# Altium schematic sheet Gen_Ai_Kbd-Main.SchDoc
size 420 x 297 mm; SheetNumber: 1; SheetTotal: 11
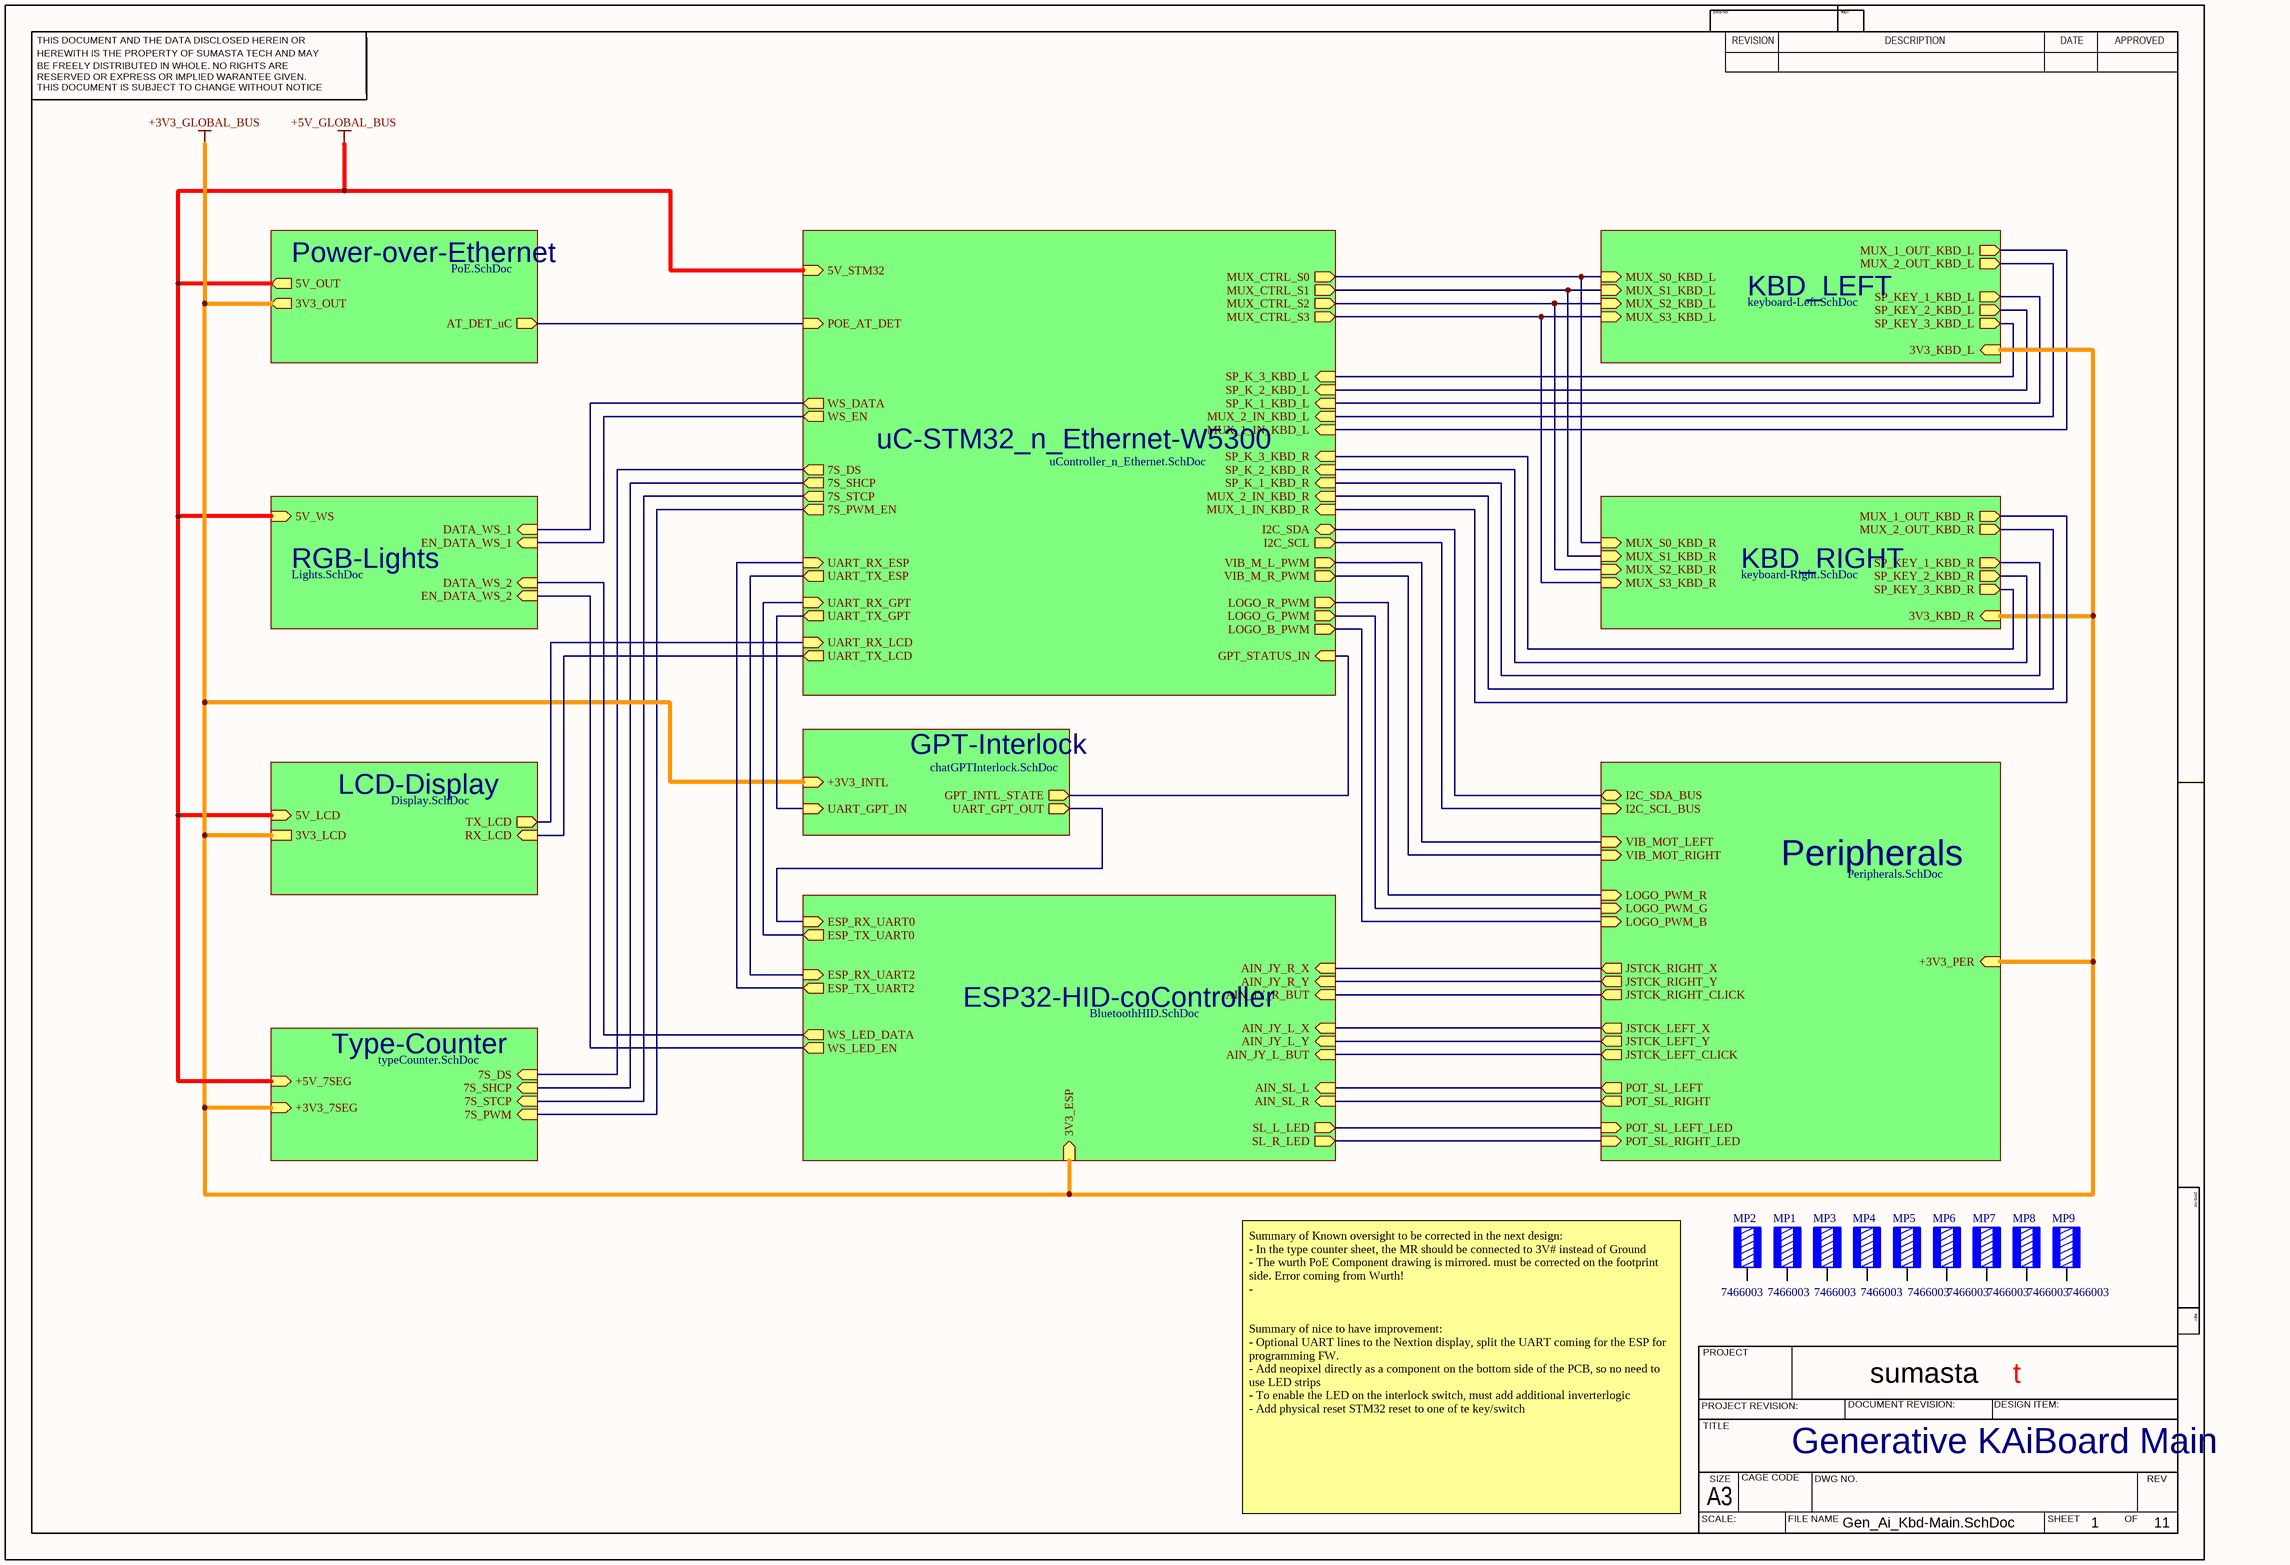
[diagram p0: Gen_Ai_Kbd-Main.SchDoc]

## Parts
MP1  7466003  [7466003]
MP2  7466003  [7466003]
MP3  7466003  [7466003]
MP4  7466003  [7466003]
MP5  7466003  [7466003]
MP6  7466003  [7466003]
MP7  7466003  [7466003]
MP8  7466003  [7466003]
MP9  7466003  [7466003]

## Sub-sheets
ESP32-HID-coController = BluetoothHID.SchDoc: 3V3_ESP (in), AIN_JY_L_X (in), AIN_JY_L_Y (in), AIN_JY_R_X (in), AIN_JY_R_Y (in), AIN_SL_R (in), AIN_SL_L (in), AIN_JY_L_BUT (in), AIN_JY_R_BUT (in), ESP_RX_UART2 (in), ESP_TX_UART2 (out), SL_R_LED (out), SL_L_LED (out), ESP_RX_UART0 (in), ESP_TX_UART0 (out), WS_LED_DATA (out), WS_LED_EN (out)
GPT-Interlock = chatGPTInterlock.SchDoc: +3V3_INTL (in), UART_GPT_IN (in), UART_GPT_OUT (out), GPT_INTL_STATE (out)
KBD_LEFT = keyboard-Left.SchDoc: MUX_S0_KBD_L (in), MUX_S1_KBD_L (in), MUX_S2_KBD_L (in), MUX_S3_KBD_L (in), 3V3_KBD_L (in), MUX_1_OUT_KBD_L (out), MUX_2_OUT_KBD_L (out), SP_KEY_1_KBD_L (out), SP_KEY_2_KBD_L (out), SP_KEY_3_KBD_L (out)
KBD_RIGHT = keyboard-Right.SchDoc: MUX_S0_KBD_R (in), MUX_S1_KBD_R (in), MUX_S2_KBD_R (in), MUX_S3_KBD_R (in), 3V3_KBD_R (in), MUX_1_OUT_KBD_R (out), MUX_2_OUT_KBD_R (out), SP_KEY_1_KBD_R (out), SP_KEY_2_KBD_R (out), SP_KEY_3_KBD_R (out)
LCD-Display = Display.SchDoc: 5V_LCD (in), TX_LCD (out), RX_LCD (in), 3V3_LCD
Peripherals = Peripherals.SchDoc: +3V3_PER (in), JSTCK_LEFT_X (out), JSTCK_LEFT_Y (out), JSTCK_LEFT_CLICK (out), JSTCK_RIGHT_X (out), JSTCK_RIGHT_Y (out), JSTCK_RIGHT_CLICK (out), LOGO_PWM_R (in), LOGO_PWM_G (in), LOGO_PWM_B (in), I2C_SDA_BUS (bidir), I2C_SCL_BUS (in), POT_SL_LEFT (out), POT_SL_RIGHT (out), POT_SL_LEFT_LED (in), POT_SL_RIGHT_LED (in), VIB_MOT_LEFT (in), VIB_MOT_RIGHT (in)
Power-over-Ethernet = PoE.SchDoc: AT_DET_uC (out), 5V_OUT (out), 3V3_OUT (out)
RGB-Lights = Lights.SchDoc: 5V_WS (in), DATA_WS_1 (in), DATA_WS_2 (in), EN_DATA_WS_1 (in), EN_DATA_WS_2 (in)
Type-Counter = typeCounter.SchDoc: +5V_7SEG (in), +3V3_7SEG (in), 7S_DS (in), 7S_SHCP (in), 7S_STCP (in), 7S_PWM (in)
uC-STM32_n_Ethernet-W5300 = uController_n_Ethernet.SchDoc: I2C_SCL (out), I2C_SDA (bidir), LOGO_R_PWM (out), LOGO_G_PWM (out), LOGO_B_PWM (out), VIB_M_L_PWM (out), VIB_M_R_PWM (out), MUX_1_IN_KBD_R (in), MUX_CTRL_S0 (out), MUX_CTRL_S1 (out), MUX_CTRL_S2 (out), MUX_CTRL_S3 (out), SP_K_1_KBD_L (in), SP_K_2_KBD_L (in), SP_K_3_KBD_L (in), SP_K_1_KBD_R (in), SP_K_2_KBD_R (in), SP_K_3_KBD_R (in), 7S_DS (out), 7S_SHCP (out), 7S_STCP (out), 7S_PWM_EN (out), POE_AT_DET (in), UART_TX_LCD (out), UART_RX_LCD (in), UART_RX_GPT (in), UART_TX_GPT (out), UART_TX_ESP (out), UART_RX_ESP (in), WS_DATA (out), WS_EN (out), 5V_STM32 (in), GPT_STATUS_IN (in), MUX_2_IN_KBD_L (in), MUX_1_IN_KBD_L (in), MUX_2_IN_KBD_R (in)

## Nets
+3V3_GLOBAL_BUS: sheet KBD_LEFT/3V3_KBD_L, sheet KBD_RIGHT/3V3_KBD_R, sheet Power-over-Ethernet/3V3_OUT, sheet LCD-Display/3V3_LCD, sheet Peripherals/+3V3_PER, sheet ESP32-HID-coController/3V3_ESP, sheet Type-Counter/+3V3_7SEG, sheet GPT-Interlock/+3V3_INTL
+5V_GLOBAL_BUS: sheet Power-over-Ethernet/5V_OUT, sheet RGB-Lights/5V_WS, sheet LCD-Display/5V_LCD, sheet uC-STM32_n_Ethernet-W5300/5V_STM32, sheet Type-Counter/+5V_7SEG
(unnamed): sheet KBD_LEFT/MUX_S0_KBD_L, sheet KBD_RIGHT/MUX_S0_KBD_R, sheet uC-STM32_n_Ethernet-W5300/MUX_CTRL_S0
(unnamed): sheet KBD_LEFT/MUX_S1_KBD_L, sheet KBD_RIGHT/MUX_S1_KBD_R, sheet uC-STM32_n_Ethernet-W5300/MUX_CTRL_S1
(unnamed): sheet KBD_LEFT/MUX_S2_KBD_L, sheet KBD_RIGHT/MUX_S2_KBD_R, sheet uC-STM32_n_Ethernet-W5300/MUX_CTRL_S2
(unnamed): sheet KBD_LEFT/MUX_S3_KBD_L, sheet KBD_RIGHT/MUX_S3_KBD_R, sheet uC-STM32_n_Ethernet-W5300/MUX_CTRL_S3
(unnamed): sheet KBD_LEFT/MUX_1_OUT_KBD_L, sheet uC-STM32_n_Ethernet-W5300/MUX_1_IN_KBD_L
(unnamed): sheet KBD_LEFT/MUX_2_OUT_KBD_L, sheet uC-STM32_n_Ethernet-W5300/MUX_2_IN_KBD_L
(unnamed): sheet KBD_LEFT/SP_KEY_1_KBD_L, sheet uC-STM32_n_Ethernet-W5300/SP_K_1_KBD_L
(unnamed): sheet KBD_LEFT/SP_KEY_2_KBD_L, sheet uC-STM32_n_Ethernet-W5300/SP_K_2_KBD_L
(unnamed): sheet KBD_LEFT/SP_KEY_3_KBD_L, sheet uC-STM32_n_Ethernet-W5300/SP_K_3_KBD_L
(unnamed): sheet KBD_RIGHT/MUX_1_OUT_KBD_R, sheet uC-STM32_n_Ethernet-W5300/MUX_1_IN_KBD_R
(unnamed): sheet KBD_RIGHT/MUX_2_OUT_KBD_R, sheet uC-STM32_n_Ethernet-W5300/MUX_2_IN_KBD_R
(unnamed): sheet KBD_RIGHT/SP_KEY_1_KBD_R, sheet uC-STM32_n_Ethernet-W5300/SP_K_1_KBD_R
(unnamed): sheet KBD_RIGHT/SP_KEY_2_KBD_R, sheet uC-STM32_n_Ethernet-W5300/SP_K_2_KBD_R
(unnamed): sheet KBD_RIGHT/SP_KEY_3_KBD_R, sheet uC-STM32_n_Ethernet-W5300/SP_K_3_KBD_R
(unnamed): sheet Power-over-Ethernet/AT_DET_uC, sheet uC-STM32_n_Ethernet-W5300/POE_AT_DET
(unnamed): sheet RGB-Lights/DATA_WS_1, sheet uC-STM32_n_Ethernet-W5300/WS_DATA
(unnamed): sheet RGB-Lights/DATA_WS_2, sheet ESP32-HID-coController/WS_LED_DATA
(unnamed): sheet RGB-Lights/EN_DATA_WS_1, sheet uC-STM32_n_Ethernet-W5300/WS_EN
(unnamed): sheet RGB-Lights/EN_DATA_WS_2, sheet ESP32-HID-coController/WS_LED_EN
(unnamed): sheet LCD-Display/TX_LCD, sheet uC-STM32_n_Ethernet-W5300/UART_RX_LCD
(unnamed): sheet LCD-Display/RX_LCD, sheet uC-STM32_n_Ethernet-W5300/UART_TX_LCD
(unnamed): sheet Peripherals/JSTCK_LEFT_X, sheet ESP32-HID-coController/AIN_JY_L_X
(unnamed): sheet Peripherals/JSTCK_LEFT_Y, sheet ESP32-HID-coController/AIN_JY_L_Y
(unnamed): sheet Peripherals/JSTCK_LEFT_CLICK, sheet ESP32-HID-coController/AIN_JY_L_BUT
(unnamed): sheet Peripherals/JSTCK_RIGHT_X, sheet ESP32-HID-coController/AIN_JY_R_X
(unnamed): sheet Peripherals/JSTCK_RIGHT_Y, sheet ESP32-HID-coController/AIN_JY_R_Y
(unnamed): sheet Peripherals/JSTCK_RIGHT_CLICK, sheet ESP32-HID-coController/AIN_JY_R_BUT
(unnamed): sheet Peripherals/LOGO_PWM_R, sheet uC-STM32_n_Ethernet-W5300/LOGO_R_PWM
(unnamed): sheet Peripherals/LOGO_PWM_G, sheet uC-STM32_n_Ethernet-W5300/LOGO_G_PWM
(unnamed): sheet Peripherals/LOGO_PWM_B, sheet uC-STM32_n_Ethernet-W5300/LOGO_B_PWM
(unnamed): sheet Peripherals/I2C_SDA_BUS, sheet uC-STM32_n_Ethernet-W5300/I2C_SDA
(unnamed): sheet Peripherals/I2C_SCL_BUS, sheet uC-STM32_n_Ethernet-W5300/I2C_SCL
(unnamed): sheet Peripherals/POT_SL_LEFT, sheet ESP32-HID-coController/AIN_SL_L
(unnamed): sheet Peripherals/POT_SL_RIGHT, sheet ESP32-HID-coController/AIN_SL_R
(unnamed): sheet Peripherals/POT_SL_LEFT_LED, sheet ESP32-HID-coController/SL_L_LED
(unnamed): sheet Peripherals/POT_SL_RIGHT_LED, sheet ESP32-HID-coController/SL_R_LED
(unnamed): sheet Peripherals/VIB_MOT_LEFT, sheet uC-STM32_n_Ethernet-W5300/VIB_M_L_PWM
(unnamed): sheet Peripherals/VIB_MOT_RIGHT, sheet uC-STM32_n_Ethernet-W5300/VIB_M_R_PWM
(unnamed): sheet uC-STM32_n_Ethernet-W5300/7S_DS, sheet Type-Counter/7S_DS
(unnamed): sheet uC-STM32_n_Ethernet-W5300/7S_SHCP, sheet Type-Counter/7S_SHCP
(unnamed): sheet uC-STM32_n_Ethernet-W5300/7S_STCP, sheet Type-Counter/7S_STCP
(unnamed): sheet uC-STM32_n_Ethernet-W5300/7S_PWM_EN, sheet Type-Counter/7S_PWM
(unnamed): sheet uC-STM32_n_Ethernet-W5300/UART_RX_GPT, sheet ESP32-HID-coController/ESP_TX_UART0
(unnamed): sheet uC-STM32_n_Ethernet-W5300/UART_TX_GPT, sheet GPT-Interlock/UART_GPT_IN
(unnamed): sheet uC-STM32_n_Ethernet-W5300/UART_TX_ESP, sheet ESP32-HID-coController/ESP_RX_UART2
(unnamed): sheet uC-STM32_n_Ethernet-W5300/UART_RX_ESP, sheet ESP32-HID-coController/ESP_TX_UART2
(unnamed): sheet uC-STM32_n_Ethernet-W5300/GPT_STATUS_IN, sheet GPT-Interlock/GPT_INTL_STATE
(unnamed): sheet ESP32-HID-coController/ESP_RX_UART0, sheet GPT-Interlock/UART_GPT_OUT

Not connected (* = marked no-connect by the designer): MP1 1; MP2 1; MP3 1; MP4 1; MP5 1; MP6 1; MP7 1; MP8 1; MP9 1

## Notes on the sheet
- Summary of Known oversight to be corrected in the next design:
  - In the type counter sheet, the MR should be connected to 3V# instead of Ground
  - The wurth PoE Component drawing is mirrored. must be corrected on the footprint side. Error coming from Wurth!
  -
  Summary of nice to have improvement:
  - Optional UART lines to the Nextion display, split the UART coming for the ESP for programming FW.
  - Add neopixel directly as a component on the bottom side of the PCB, so no need to use LED strips
  - To enable the LED on the interlock switch, must add additional inverterlogic
  - Add physical reset STM32 reset to one of te key/switch
- Generative KAiBoard Main
- THIS DOCUMENT AND THE DATA DISCLOSED HEREIN OR
- HEREWITH IS THE PROPERTY OF SUMASTA TECH AND MAY
- DWG NO:
- REVISION
- REV:
- DESCRIPTION
- DATE
- APPROVED
- BE FREELY DISTRIBUTED IN WHOLE. NO RIGHTS ARE
- THIS DOCUMENT IS SUBJECT TO CHANGE WITHOUT NOTICE
- RESERVED OR EXPRESS OR IMPLIED WARANTEE GIVEN.
- PROJECT
- sumasta
- t
- PROJECT REVISION:
- TITLE
- DOCUMENT REVISION:
- DESIGN ITEM:
- SCALE:
- A3
- SIZE
- CAGE CODE
- FILE NAME
- DWG NO.
- SHEET
- OF
- REV

## Library data of the parts
MP1-MP9 = CMP-03913-34964368-1: 7466003 WP-SMBU REDCUBE Bush, SMT_open; Current Rating: 50A; Thread Size: M3; Number of Contacts: 1; Number of Pins: 1; RoHS: Compliant; Material: Brass; Mount: Surface Mount; Contact Plating: Tin; Min Operating Temperature: -55°C; REACH SVHC: Unknown; Max Operating Temperature: 150°C; Termination: Power; Contact Material: Brass; Length: 7mm; Height: 5mm; Packaging: Bulk; NexarPartId: 34964368